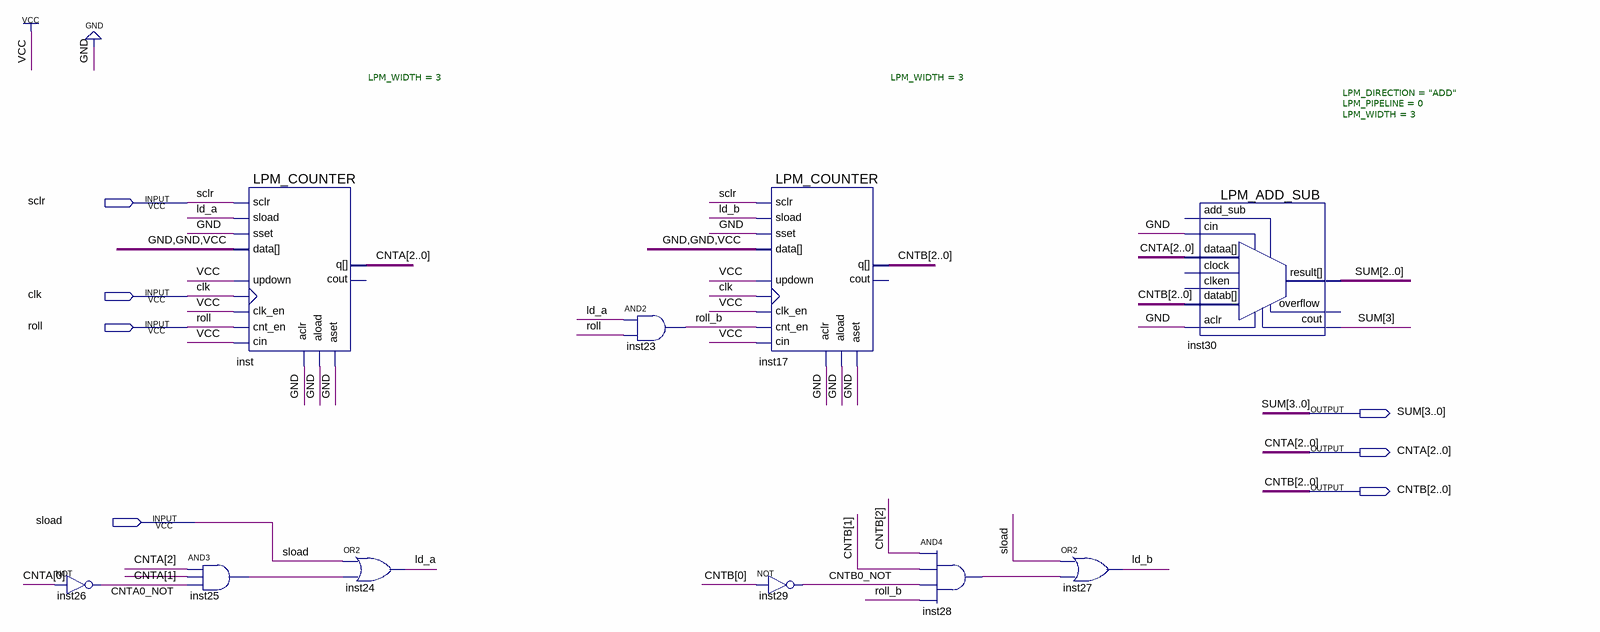
[diagram p0: schematic sheet]
// Quartus schematic dpatha.bdf as structural Verilog: 10 symbols, 7 pins
module dpatha (
  input  sclr,
  input  clk,
  input  roll,
  input  sload,
  output [3:0] SUM,
  output [2:0] CNTA,
  output [2:0] CNTB
);

  wire CNTA0_NOT, CNTB0_NOT, inst25_out, inst28_out, ld_a, ld_b, roll_b;

  not inst26 (CNTA0_NOT, CNTA[0]);
  and inst25 (inst25_out, CNTA[2], CNTA[1], CNTA0_NOT);
  LPM_COUNTER #(.LPM_WIDTH(3)) inst (
    .sload(ld_a), .data(3'b001), .clock(clk), .clk_en(1'b1), .aload(1'b0), .aclr(1'b0), .aset(1'b0),
    .cin(1'b1), .sset(1'b0), .updown(1'b1), .cnt_en(roll), .sclr(sclr), .q(CNTA));  // open: cout
  or inst24 (ld_a, sload, inst25_out);
  and inst23 (roll_b, ld_a, roll);
  LPM_COUNTER #(.LPM_WIDTH(3)) inst17 (
    .sload(ld_b), .data(3'b001), .clock(clk), .clk_en(1'b1), .aload(1'b0), .aclr(1'b0), .aset(1'b0),
    .cin(1'b1), .sset(1'b0), .updown(1'b1), .cnt_en(roll_b), .sclr(sclr), .q(CNTB));  // open: cout
  not inst29 (CNTB0_NOT, CNTB[0]);
  and inst28 (inst28_out, CNTB[2], CNTB[1], CNTB0_NOT, roll_b);
  or inst27 (ld_b, sload, inst28_out);
  LPM_ADD_SUB #(.LPM_DIRECTION("ADD"), .LPM_PIPELINE(0), .LPM_WIDTH(3)) inst30 (
    .datab(CNTB), .dataa(CNTA), .cin(1'b0), .aclr(1'b0), .cout(SUM[3]), .result(SUM[2:0]));  // open: add_sub, clock, clken, overflow
endmodule
